# Altium project SR8_MPPT.PrjPcb (part 3 of 3)

## Sheet auxilliary.SchDoc: Auxiliary Support Circuits
size A3; DrawnBy: Angus Macdonald; SheetNumber: 4; SheetTotal: 5
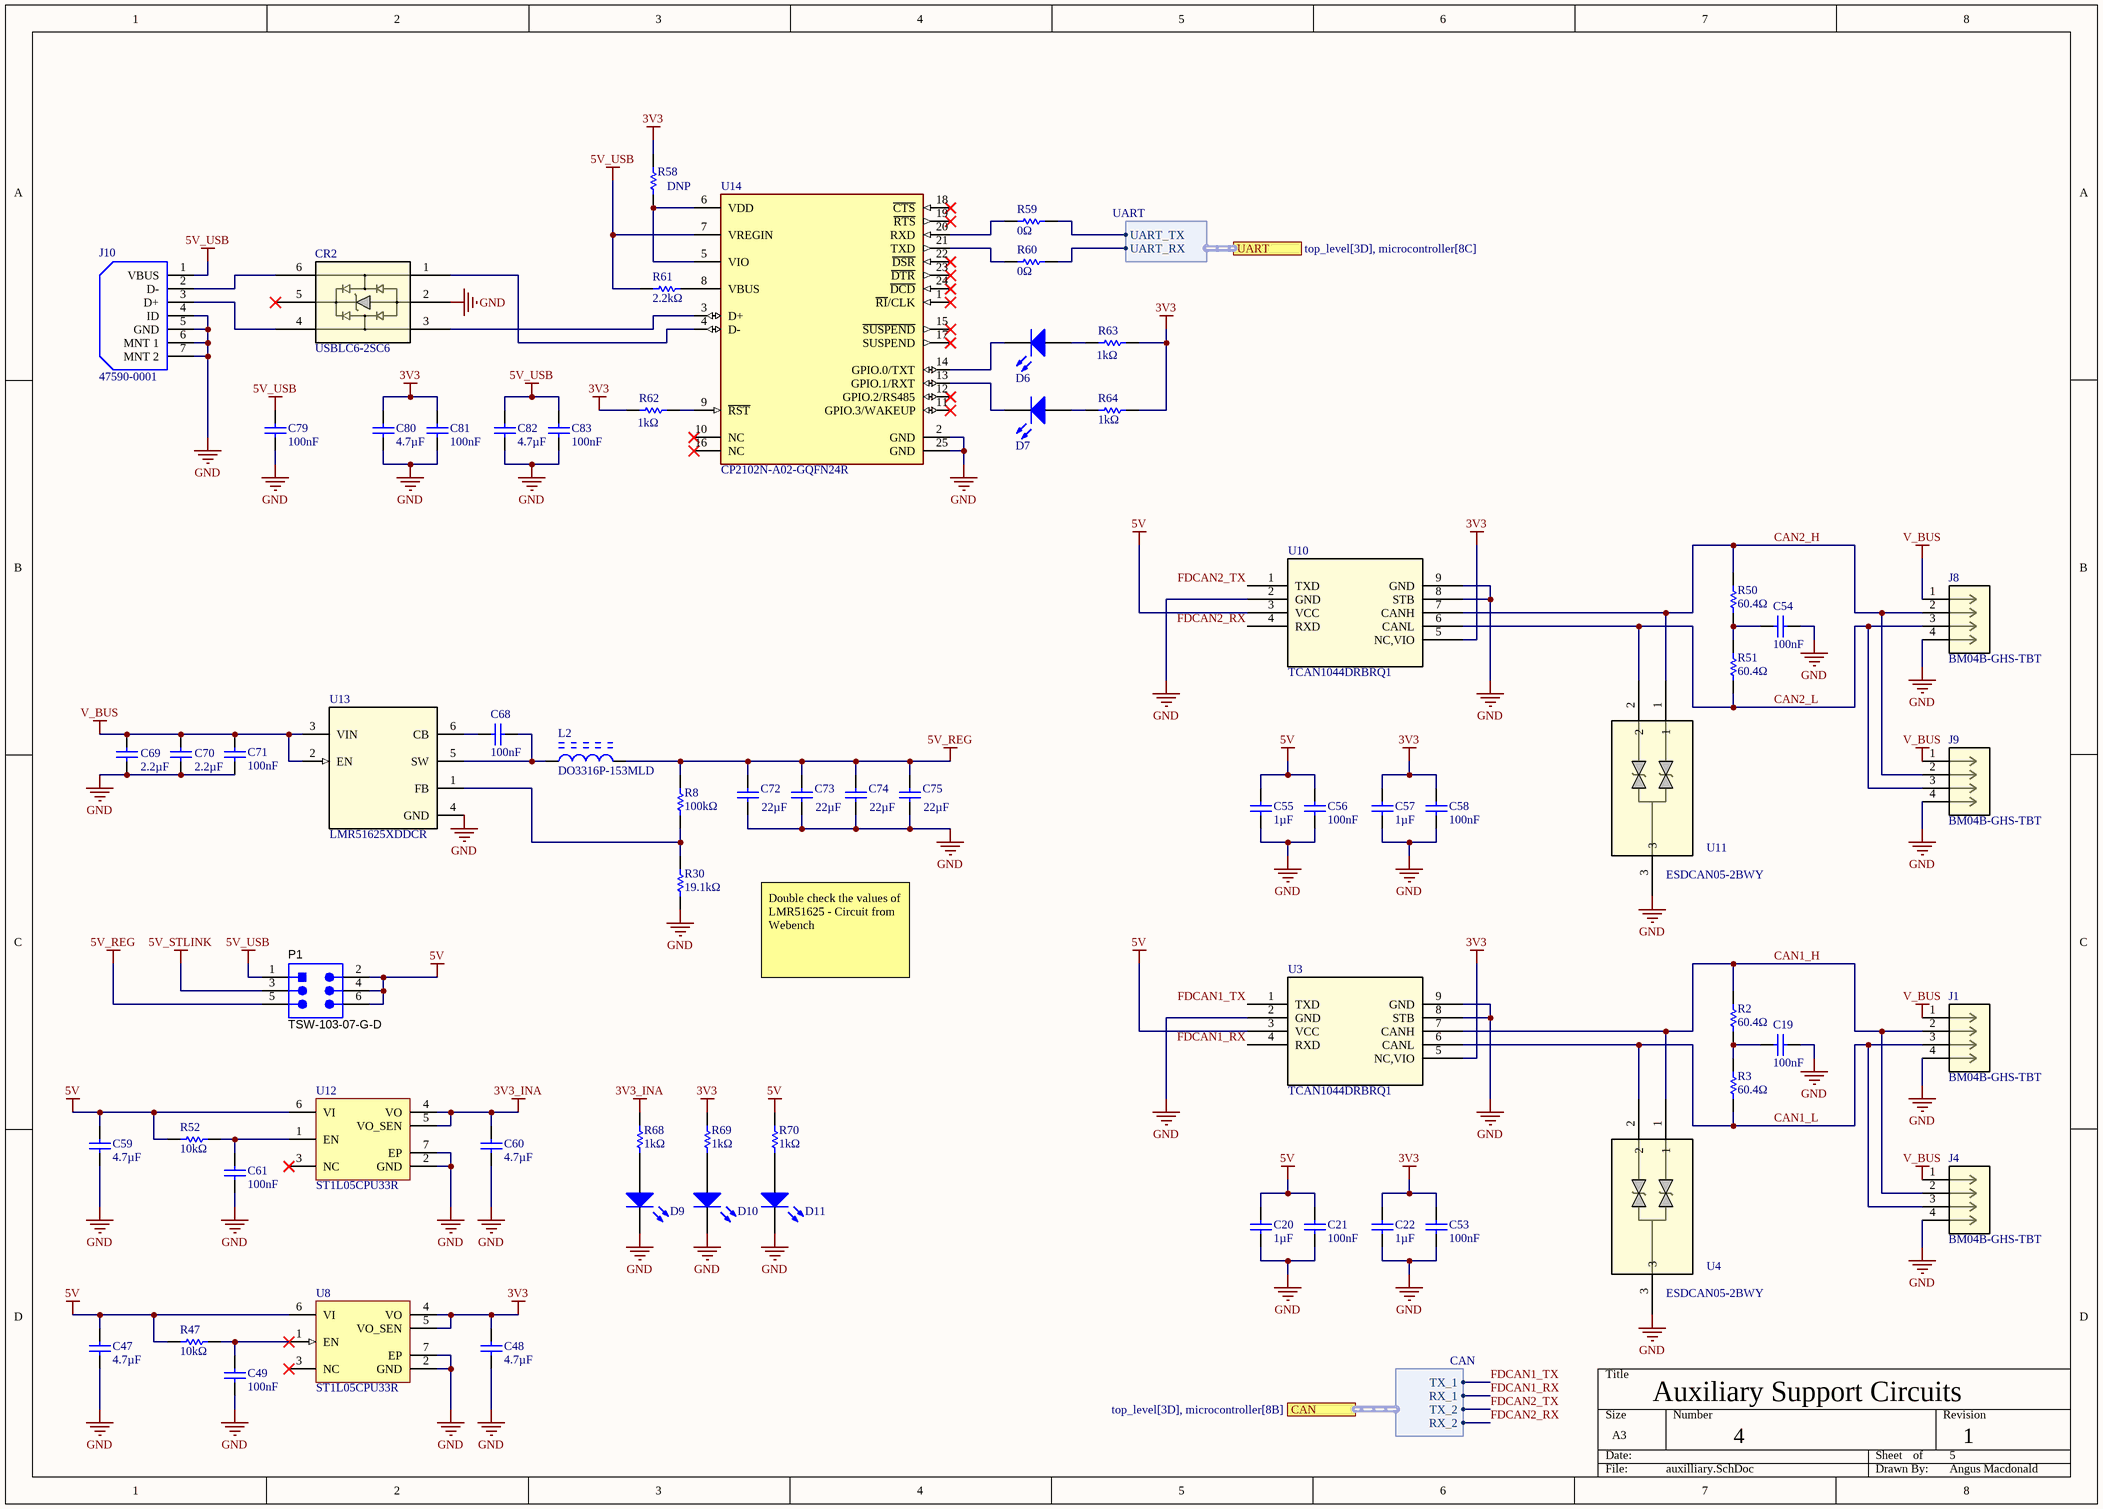
[diagram p4: auxilliary.SchDoc]

### Parts
C19  value 100nF  [C0603]  (hidden comment: CC0603KRX7R8BB104)
C20  value 1µF  [C0603]  (hidden comment: CC0603KRX7R7BB105)
C21  value 100nF  [C0603]  (hidden comment: CC0603KRX7R8BB104)
C22  value 1µF  [C0603]  (hidden comment: CC0603KRX7R7BB105)
C47  value 4.7µF  [C0603]  (hidden comment: CC0603KRX5R7BB475)
C48  value 4.7µF  [C0603]  (hidden comment: CC0603KRX5R7BB475)
C49  value 100nF  [C0603]  (hidden comment: CC0603KRX7R8BB104)
C53  value 100nF  [C0603]  (hidden comment: CC0603KRX7R8BB104)
C54  value 100nF  [C0603]  (hidden comment: CC0603KRX7R8BB104)
C55  value 1µF  [C0603]  (hidden comment: CC0603KRX7R7BB105)
C56  value 100nF  [C0603]  (hidden comment: CC0603KRX7R8BB104)
C57  value 1µF  [C0603]  (hidden comment: CC0603KRX7R7BB105)
C58  value 100nF  [C0603]  (hidden comment: CC0603KRX7R8BB104)
C59  value 4.7µF  [C0603]  (hidden comment: CC0603KRX5R7BB475)
C60  value 4.7µF  [C0603]  (hidden comment: CC0603KRX5R7BB475)
C61  value 100nF  [C0603]  (hidden comment: CC0603KRX7R8BB104)
C68  value 100nF  [C0603]  (hidden comment: CC0603JRX7R0BB104)
C69  value 2.2µF  [FP-CC1206-1_25-IPC_B]  (hidden comment: CC1206KKX7R0BB225)
C70  value 2.2µF  [FP-CC1206-1_25-IPC_B]  (hidden comment: CC1206KKX7R0BB225)
C71  value 100nF  [C0603]  (hidden comment: CC0603JRX7R0BB104)
C72  value 22µF  [FP-CC1206-1_25-IPC_B]  (hidden comment: CC1206KKX7R6BB226)
C73  value 22µF  [FP-CC1206-1_25-IPC_B]  (hidden comment: CC1206KKX7R6BB226)
C74  value 22µF  [FP-CC1206-1_25-IPC_B]  (hidden comment: CC1206KKX7R6BB226)
C75  value 22µF  [FP-CC1206-1_25-IPC_B]  (hidden comment: CC1206KKX7R6BB226)
C79  value 100nF  [C0603]  (hidden comment: CC0603KRX7R8BB104)
C80  value 4.7µF  [C0603]  (hidden comment: CC0603KRX5R7BB475)
C81  value 100nF  [C0603]  (hidden comment: CC0603KRX7R8BB104)
C82  value 4.7µF  [C0603]  (hidden comment: CC0603KRX5R7BB475)
C83  value 100nF  [C0603]  (hidden comment: CC0603KRX7R8BB104)
CR2  USBLC6-2SC6  [SOT23-6L_STM]
D6  LED RED 0805  [0805 LED]  (value not drawn)
D7  LED EMERALD 0805  [0805 LED]  (value not drawn)
D9  LED EMERALD 0805  [0805 LED]  (value not drawn)
D10  LED EMERALD 0805  [0805 LED]  (value not drawn)
D11  LED EMERALD 0805  [0805 LED]  (value not drawn)
J1  BM04B-GHS-TBT  [CONN_BM04B-GHS-TBT_JST]
J4  BM04B-GHS-TBT  [CONN_BM04B-GHS-TBT_JST]
J8  BM04B-GHS-TBT  [CONN_BM04B-GHS-TBT_JST]
J9  BM04B-GHS-TBT  [CONN_BM04B-GHS-TBT_JST]
J10  47590-0001  [USB]
L2  DO3316P-153MLD  [COIL-DO3316P_V]
P1  TSW-103-07-G-D  [SMTC-TSW-103-07-G-D_V]
R2  value 60.4Ω  [RESC1608X55X25ML10T15]  (hidden comment: RC0603FR-0760R4L)
R3  value 60.4Ω  [RESC1608X55X25ML10T15]  (hidden comment: RC0603FR-0760R4L)
R8  value 100kΩ  [RESC1608X55X25ML10T15]  (hidden comment: RC0603FR-07100KL)
R30  value 19.1kΩ  [RESC1608X55X25ML10T15]  (hidden comment: RC0603FR-0719K1L)
R47  value 10kΩ  [RESC1608X55X25ML10T15]  (hidden comment: RC0603FR-0710KL)
R50  value 60.4Ω  [RESC1608X55X25ML10T15]  (hidden comment: RC0603FR-0760R4L)
R51  value 60.4Ω  [RESC1608X55X25ML10T15]  (hidden comment: RC0603FR-0760R4L)
R52  value 10kΩ  [RESC1608X55X25ML10T15]  (hidden comment: RC0603FR-0710KL)
R58  DNP  [RESC1608X55X25ML10T15]
R59  value 0Ω  [RESC1608X55X25ML10T15]  (hidden comment: RC0603JR-070RL)
R60  value 0Ω  [RESC1608X55X25ML10T15]  (hidden comment: RC0603JR-070RL)
R61  value 2.2kΩ  [RESC1608X55X25ML10T15]  (hidden comment: RC0603FR-072K2L)
R62  value 1kΩ  [RESC1608X55X25ML10T15]  (hidden comment: RC0603FR-101KL)
R63  value 1kΩ  [RESC1608X55X25ML10T15]  (hidden comment: RC0603FR-101KL)
R64  value 1kΩ  [RESC1608X55X25ML10T15]  (hidden comment: RC0603FR-101KL)
R68  value 1kΩ  [RESC1608X55X25ML10T15]  (hidden comment: RC0603FR-101KL)
R69  value 1kΩ  [RESC1608X55X25ML10T15]  (hidden comment: RC0603FR-101KL)
R70  value 1kΩ  [RESC1608X55X25ML10T15]  (hidden comment: RC0603FR-101KL)
U3  TCAN1044DRBRQ1  [SON_4DRBRQ1_TEX]
U4  ESDCAN05-2BWY  [SOT323-3L_STM]
U8  ST1L05CPU33R  [DFN6D_L]
U10  TCAN1044DRBRQ1  [SON_4DRBRQ1_TEX]
U11  ESDCAN05-2BWY  [SOT323-3L_STM]
U12  ST1L05CPU33R  [DFN6D_L]
U13  LMR51625XDDCR  [DDC0006A-MFG]
U14  CP2102N-A02-GQFN24R  [FP-CP2102N-A02-GQFN24R-IPC_C]

### Ports
CAN (harness CAN, see top_level[3D], microcontroller[8B]), UART (harness UART, see top_level[3D], microcontroller[8C])

### Harnesses
CAN: TX_1, RX_1, TX_2, RX_2
UART: UART_TX, UART_RX

### Nets
3V3: C22.2 C48.2 C53.2 C57.2 C58.2 C80.2 C81.2 R58.1 R62.1 R63.2 R64.2 R69.1 U3.5(NC,VIO) U8.4(VO) U8.5(VO_SEN) U10.5(NC,VIO)
3V3_INA: C60.2 R68.1 U12.4(VO) U12.5(VO_SEN)
5V: C20.2 C21.2 C47.2 C55.2 C56.2 C59.2 P1.2 P1.4 P1.6 R47.1 R52.1 R70.1 U3.3(VCC) U8.6(VI) U10.3(VCC) U12.6(VI)
5V_REG: C72.1 C73.1 C74.1 C75.1 L2.2 P1.5 R8.2
5V_STLINK: P1.3
5V_USB: C79.2 C82.2 C83.2 J10.1(VBUS) P1.1 R61.2 U14.7(VREGIN)
GND: C19.1 C20.1 C21.1 C22.1 C47.1 C48.1 C49.1 C53.1 C54.1 C55.1 C56.1 C57.1 C58.1 C59.1 C60.1 C61.1 C69.2 C70.2 C71.2 C72.2 C73.2 C74.2 C75.2 C79.1 C80.1 C81.1 C82.1 C83.1 CR2.2 D9.K D10.K D11.K J1.4 J4.4 J8.4 J9.4 J10.4(ID) J10.5(GND) J10.6(MNT_1) J10.7(MNT_2) R30.1 U3.2(GND) U3.8(STB) U3.9(GND) U4.3 U8.2(GND) U8.7(EP) U10.2(GND) U10.8(STB) U10.9(GND) U11.3 U12.2(GND) U12.7(EP) U13.4(GND) U14.2(GND) U14.25(GND)
V_BUS: C69.1 C70.1 C71.1 J1.1 J4.1 J8.1 J9.1 U13.2(EN) U13.3(VIN)
CAN1_H: J1.2 J4.2 R2.2 U3.7(CANH) U4.1
CAN1_L: J1.3 J4.3 R3.1 U3.6(CANL) U4.2
CAN2_H: J8.2 J9.2 R50.2 U10.7(CANH) U11.1
CAN2_L: J8.3 J9.3 R51.1 U10.6(CANL) U11.2
FDCAN1_RX: U3.4(RXD) ; port CAN.RX_1
FDCAN1_TX: U3.1(TXD) ; port CAN.TX_1
FDCAN2_RX: U10.4(RXD) ; port CAN.RX_2
FDCAN2_TX: U10.1(TXD) ; port CAN.TX_2
UART_RX: R60.1 ; port UART.UART_RX
UART_TX: R59.1 ; port UART.UART_TX
NetC19_2: C19.2 R2.1 R3.2
NetC49_2: C49.2 R47.2 U8.1(EN)
NetC54_2: C54.2 R50.1 R51.2
NetC61_2: C61.2 R52.2 U12.1(EN)
NetC68_1: C68.1 U13.6(CB)
NetC68_2: C68.2 L2.1 U13.5(SW)
NetCR2_1: CR2.1 U14.4(D-)
NetCR2_3: CR2.3 U14.3(D+)
NetCR2_4: CR2.4 J10.3(D+)
NetCR2_6: CR2.6 J10.2(D-)
NetD6_A: D6.A R63.1
NetD6_K: D6.K U14.14(GPIO.0/TXT)
NetD7_A: D7.A R64.1
NetD7_K: D7.K U14.13(GPIO.1/RXT)
NetD9_A: D9.A R68.2
NetD10_A: D10.A R69.2
NetD11_A: D11.A R70.2
NetR8_1: R8.1 R30.2 U13.1(FB)
NetR58_2: R58.2 U14.5(VIO) U14.6(VDD)
NetR59_2: R59.2 U14.20(RXD)
NetR60_2: R60.2 U14.21(TXD)
NetR61_1: R61.1 U14.8(VBUS)
NetR62_2: R62.2 U14.9(~{RST})

Not connected (* = marked no-connect by the designer): CR2 5*; U8 3(NC)*; U12 3(NC)*; U14 1(~{RI}/CLK)* 10(NC)* 11(GPIO.3/WAKEUP)* 12(GPIO.2/RS485)* 15(~{SUSPEND})* 16(NC)* 17(SUSPEND)* 18(~{CTS})* 19(~{RTS})* 22(~{DSR})* 23(~{DTR})* 24(~{DCD})*

### Notes on the sheet
- Double check the values of LMR51625 - Circuit from Webench

### Library data of the parts
C19 C21 C49 C53 C54 C56 C58 C61 C79 C81 C83 = CMP-00179-1: 25V 100nF X7R ±10% 0603 Multilayer Ceramic Capacitors MLCC - SMD/SMT ROHS; Length: 1.6mm; Pins: 2; Case/Package: 0603; Composition: Ceramic; Lead Free: Lead Free; Lifecycle Status: Production; RoHS: Compliant; China RoHS: Compliant; Number of Terminals: 2; Max Operating Temperature: 125°C; Tolerance: 10%; Width: 800µm; Dielectric Material: Ceramic; Voltage Rating (DC): 25V; Depth: 800µm; Min Operating Temperature: -55°C; Halogen Free: Halogen Free; Mounting Technology: Surface Mount; Material: Ceramic; REACH SVHC: Yes; Case Code (Imperial): 0603; Height: 800µm; Schedule B: 8532240020, 8532240020; Voltage Rating: 25V; Thickness: 889µm; Termination: SMD/SMT; Dielectric: X7R; Radiation Hardening: No; Voltage: 25V; Case Code (Metric): 1608
C20 C22 C55 C57 = CMP-00211-1: 16V 1uF X7R ±10% 0603 Multilayer Ceramic Capacitors MLCC - SMD/SMT ROHS; Dissipation Factor: 5%; Harmonized Tariff Schedule (HTS) Code: 8532.24.00.20; Width: 800µm; Country of Origin: Mainland China, Taiwan; Case Code (Imperial): 0603; Schedule B: 8532240020, 8532240020; Halogen Free: Halogen Free; Lifecycle Status: Production; China RoHS: Compliant; Max Operating Temperature: 125°C; Export Control Classification Number (ECCN) Code: EAR99; Min Operating Temperature: -55°C; Radiation Hardening: No; Dielectric Material: Ceramic; Voltage: 16V; RoHS: Compliant; Voltage Rating (DC): 16V; Termination: SMD/SMT; Material: Ceramic; Mounting Technology: Surface Mount; Case Code (Metric): 1608; Case/Package: 0603; Depth: 800µm; Voltage Rating: 16V; Dielectric: X7R; Thickness: 889µm; Lead Free: Lead Free; Length: 1.6mm; REACH SVHC: Yes; Height: 800µm; Introduction Date: 2009-04-17; Tolerance: 10%; Composition: Ceramic; Number of Terminals: 2; Pins: 2
C47 C48 C59 C60 C80 C82 = CMP-00273-1: 16V 4.7uF X5R ±10% 0603 Multilayer Ceramic Capacitors MLCC - SMD/SMT ROHS; Halogen Free: Halogen Free; Depth: 800µm; Case/Package: 0603; China RoHS: Compliant; REACH SVHC: Yes; Height: 800µm; Harmonized Tariff Schedule (HTS) Code: 8532.24.00.20; Width: 800µm; Export Control Classification Number (ECCN) Code: EAR99; Voltage Rating (DC): 16V; Number of Terminals: 2; Country of Origin: Mainland China, Taiwan; Thickness: 939.8µm; Material: Ceramic; Introduction Date: 2013-02-05; RoHS: Compliant; Dielectric: X5R; Voltage Rating: 16V; Max Operating Temperature: 85°C; Case Code (Imperial): 0603; Mounting Technology: Surface Mount; Composition: Ceramic; Min Operating Temperature: -55°C; Length: 1.6mm; Tolerance: 10%; Lead Free: Lead Free; Lifecycle Status: Production; Schedule B: 8532240020, 8532240020; Dielectric Material: Ceramic; Termination: SMD/SMT; Case Code (Metric): 1608; Weight: 2.012816mg
C68 C71 = CMP-00275-1: Ceramic Capacitor, Ceramic, 100V, 5% +Tol, 5% -Tol, X7R, 0.15 TC, 0.1uF, Surface Mount, 0603; RoHS: Compliant; Voltage Rating (DC): 100V; Length: 1.6mm; Dielectric Material: Ceramic; REACH SVHC: Yes; Case/Package: 0603; China RoHS: Compliant; Mounting Technology: Surface Mount; Height: 800µm; Lifecycle Status: Production; Width: 800µm; Min Operating Temperature: -55°C; Number of Terminals: 2; Max Operating Temperature: 125°C
C69 C70 = CMP-00184-1: 1206 2.2 uF 100 V ±10% Tolerance X7R SMT Multilayer Ceramic Chip Capacitor; Voltage Rating: 100V; Lifecycle Status: Production; RoHS: Compliant; REACH SVHC: Yes; Height: 1.6mm; Schedule B: 8532240020, 8532240020; Max Operating Temperature: 125°C; Number of Terminals: 2; Dielectric Material: Ceramic; Width: 1.6mm; Case/Package: 1206; Length: 3.2mm; Thickness: 1.4478mm; Tolerance: 10%; Min Operating Temperature: -55°C; Mounting Technology: Surface Mount; Material: Ceramic; Voltage Rating (DC): 100V; China RoHS: Compliant
C72-C75 = CMP-00279-1: 10V 22uF X7R ±10% 1206 Multilayer Ceramic Capacitors MLCC - SMD/SMT ROHS; Mounting Technology: Surface Mount; Dielectric Material: Ceramic; Case Code (Metric): 3216; Lifecycle Status: Production; Halogen Free: Halogen Free; Lead Free: Lead Free; Voltage Rating (DC): 10V; Termination: SMD/SMT; Schedule B: 8532240020, 8532240020; Dielectric: X7R; RoHS: Compliant; Case Code (Imperial): 1206; Thickness: 1.8034mm; Case/Package: 1206; China RoHS: Compliant; Harmonized Tariff Schedule (HTS) Code: 8532.24.00.20; Width: 1.6mm; Max Operating Temperature: 125°C; Min Operating Temperature: -55°C; Export Control Classification Number (ECCN) Code: EAR99; Packaging: Tape & Reel (TR); Length: 3.2mm; Country of Origin: Mainland China, Taiwan; Tolerance: 10%; Composition: Ceramic; REACH SVHC: Yes; Height: 1.6mm; Voltage Rating: 10V; Weight: 16.187578mg; Introduction Date: 2014-07-08; Number of Terminals: 2
CR2 = CMP-304-000000-1: ESD Protection for USB 2.0 High Speed; Manufacturer_Name: STMicroelectronics; Type: Type; Design Item ID: USBLC6-2SC6; RefDes: RefDes; Source: USBLC6-2SC6.SchLib; Manufacturer_Part_Number: USBLC6-2SC6; Copyright: Copyright (C) 2025 Ultra Librarian. All rights reserved.
D6 = CMP-002-000018-2: Red 0805  Light Emitting Diodes (LED) ROHS JLCPCB PICK&PLACE; Manufacturer: Foshan NationStar Optoelectronics; MFR.Part #: C84256; JLCPCB Part #: C84256; Color: Red
D7 D9-D11 = CMP-002-000017-2: Emerald 0805  Light Emitting Diodes (LED) ROHS GREEN JLCPCB PICK&PLACE; MFR.Part #: C2297; Manufacturer: Hubei KENTO Elec; Color: Emerald; JLCPCB Part #: C2297
J1 J4 J8 J9 = CMP-189-000000-2: Description; Manufacturer_Name: JST; Source: BM04B-GHS-TBT.SchLib; Copyright: Copyright (C) 2026 Ultra Librarian. All rights reserved.; Design Item ID: BM04B-GHS-TBT; Type: Type; Manufacturer_Part_Number: BM04B-GHS-TBT; RefDes: RefDes
J10 = CMP-014-000015-2: USB Connector Micro-AB SMD, 5 Contact(s), Female, Right Angle, Surface Mount Terminal, Locking, Receptacle, JLCPCB, PICK&PLACE; Manufacturer: MOLEX; MFR.Part #: 475900001; Source: https://jlcpcb.com/partdetail/Molex-475900001/C136001; JLCPCB Part #: C136001
L2 = CMP-050-000032-1: General Purpose Inductor, 15uH, 20%, 1 Element, Ferrite-Core, SMD, 5137; Self Resonant Frequency: 27MHz; Max DC Current: 3.1A; DC Resistance (DCR): 46mΩ; Value: 15µH; Shielding: Unshielded; Test Frequency: 100kHz; Saturation Current: 3A; Number of Circuits: 1; Length: 12.95mm; Country of Origin: Mainland China; Tolerance: 20%; Introduction Date: 2005-05-06; Min Operating Temperature: -40°C; Termination: SMD/SMT; Max Operating Temperature: 85°C; RoHS: Compliant; RMS Current (Irms): 3.1A; Core Material: Ferrite; Max Current Rating: 3.1A; REACH SVHC: Yes; Packaging: Cut Tape; Number of Terminals: 2; Width: 9.4mm; Lead Free: Contains Lead; Height: 5.21mm; Inductance Tolerance: 20%; Lifecycle Status: Production; Export Control Classification Number (ECCN) Code: EAR99; Harmonized Tariff Schedule (HTS) Code: 8504.50.80.00
P1 = CMP-014-000047-1: CONN HEADER VERT 6POS 2.54MM / Connector Header Through Hole 6 position 0.100" (2.54mm); Manufacturer Lifecycle Status: PRODUCTION; Max Voltage Rating (AC): 550V; Number of Contacts: 6; Connector Type: Male Pin; Gender: Male; Max Current Rating: 7.6A; Orientation: Straight; Width: 5.08mm; Pins: 6; Row Spacing: 2.54mm; Termination: Solder; REACH SVHC: No; Mounting Technology: Through Hole; Lead Pitch: 2.54mm; Number of Positions: 6; Lead Free: Lead Free; Number of Rows: 2; Min Operating Temperature: -55°C; Pitch: 2.54mm; Packaging: Bulk; Housing Color: Black; Contact Mating Length: 5.842mm; Contact Material: Bronze; RoHS: Compliant; Radiation Hardening: No; Color: Black; Depth: 5.08mm; Max Operating Temperature: 125°C; Lifecycle Status: Production; Contact Plating: Gold; Housing Material: Polyester
R2 R3 R50 R51 = CMP-RES-00051-1: Res Thick Film 0603 60.4 Ohm 1% 0.1W(1/10W) ±100ppm/C Pad SMD T/R; Working Voltage: 75V; Temperature Coefficient: 100ppm/°C; Power Dissipation: 100mW; Voltage Rating (DC): 50V; Introduction Date: 2004-09-22; Number of Terminals: 2; Harmonized Tariff Schedule (HTS) Code: 8533.21.00.30; Export Control Classification Number (ECCN) Code: EAR99; Height: 450µm; Width: 800µm; Tolerance: 1%; Case/Package: 0603; Lifecycle Status: Production; Packaging: Tape & Reel; Depth: 800µm; Power Rating: 100mW; RoHS: Compliant; Voltage Rating: 75V; REACH SVHC: Yes; Schedule B: 8533210045, 8533210045; China RoHS: Non-Compliant; Min Operating Temperature: -55°C; Country of Origin: Mainland China, Taiwan; Composition: Thick Film; Termination: SMD/SMT; Case Code (Imperial): 0603; Length: 1.6mm; Lead Free: Lead Free; Military Standard: Not; Max Operating Temperature: 155°C; Mounting Technology: Surface Mount
R8 = CMP-RES-00026-1: Res General Purpose Thick Film 0603 100k Ohm 1% 1/10W ±100ppm/°C Molded Paper T/R; Working Voltage: 75V; Voltage Rating (DC): 50V; Power Dissipation: 100mW; Tolerance: 1%; Number of Terminations: 2; Pins: 2; China RoHS: Non-Compliant; Schedule B: 8533210045, 8533210045; Military Standard: Not; Max Operating Temperature: 155°C; Depth: 800µm; Height: 450µm; Voltage Rating: 75V; Case/Package: 0603; Length: 1.6mm; Packaging: Tape & Reel; RoHS: Compliant; Width: 800µm; Power Rating: 100mW; Number of Terminals: 2; Case Code (Imperial): 0603; Lead Free: Lead Free; Termination: SMD/SMT; Case Code (Metric): 0603; Mounting Technology: Surface Mount; Composition: Thick Film; Min Operating Temperature: -55°C; REACH SVHC: Yes; Temperature Coefficient: 100ppm/°C; Lifecycle Status: Production
R30 = CMP-RES-00091-1: 100mW Thick Film Resistors 75V ±100ppm/℃ ±1% 19.1kΩ 0603 Chip Resistor - Surface Mount ROHS; Voltage Rating (DC): 50V; Temperature Coefficient: 100ppm/°C; Contact Plating: Tin; Working Voltage: 75V; REACH SVHC: Yes; Mounting Technology: Surface Mount; Case/Package: 0603; Lead Free: Lead Free; Voltage Rating: 75V; China RoHS: Non-Compliant; Lifecycle Status: Production; Min Operating Temperature: -55°C; Max Operating Temperature: 155°C; Height: 450µm; Number of Terminals: 2; Packaging: Tape & Reel; Composition: Thick Film; Power Rating: 100mW; Length: 1.6mm; Depth: 800µm; Tolerance: 1%; Schedule B: 8533210045, 8533210045; Case Code (Imperial): 0603; Military Standard: Not; Number of Terminations: 2; Termination: SMD/SMT; Width: 800µm; RoHS: Compliant
R47 R52 = CMP-RES-00040-1: 10 kOhms ±1% 0.1W, 1/10W Chip Resistor 0603 (1608 Metric) Moisture Resistant Thick Film; Tolerance: 1%; Case/Package: 0603
R58 = CMP-RES-00050-1: GENERAL PURPOSE CHIP RESISTOR Metal Glaze/thick Film, 0.1W, 0ohm, Surface Mount, 0603; Power Rating: 100mW; Tolerance: 1%; Voltage Rating: 50V; Value: 0Ω; Temperature Coefficient: 200ppm/°C; Termination: SMD/SMT; Number of Terminals: 2; Pins: 2; Contact Plating: Tin; Case/Package: 0603; Length: 1.6mm; Military Standard: Not; Power Dissipation: 100mW; Introduction Date: 2001-06-08; Case Code (Imperial): 0603; Voltage Rating (DC): 50V; Min Operating Temperature: -55°C; Composition: Thick Film; Export Control Classification Number (ECCN) Code: EAR99; Country of Origin: Mainland China, Taiwan; Height: 450µm; RoHS: Compliant; Depth: 800µm; Lifecycle Status: Production; Width: 800µm; Max Operating Temperature: 155°C; Harmonized Tariff Schedule (HTS) Code: 8533.21.00.30; Radiation Hardening: No; Packaging: Cut Tape; China RoHS: Non-Compliant; Lead Free: Lead Free; REACH SVHC: Yes; Mounting Technology: Surface Mount
R59 R60 = CMP-RES-00050-1: GENERAL PURPOSE CHIP RESISTOR Metal Glaze/thick Film, 0.1W, 0ohm, Surface Mount, 0603; Power Rating: 100mW; Tolerance: 1%; Voltage Rating: 50V; Temperature Coefficient: 200ppm/°C; Termination: SMD/SMT; Number of Terminals: 2; Pins: 2; Contact Plating: Tin; Case/Package: 0603; Length: 1.6mm; Military Standard: Not; Power Dissipation: 100mW; Introduction Date: 2001-06-08; Case Code (Imperial): 0603; Voltage Rating (DC): 50V; Min Operating Temperature: -55°C; Composition: Thick Film; Export Control Classification Number (ECCN) Code: EAR99; Country of Origin: Mainland China, Taiwan; Height: 450µm; RoHS: Compliant; Depth: 800µm; Lifecycle Status: Production; Width: 800µm; Max Operating Temperature: 155°C; Harmonized Tariff Schedule (HTS) Code: 8533.21.00.30; Radiation Hardening: No; Packaging: Cut Tape; China RoHS: Non-Compliant; Lead Free: Lead Free; REACH SVHC: Yes; Mounting Technology: Surface Mount
R61 = CMP-RES-00092-1: 100Mw Thick Film Resistors 100Ppm/ 1% 2.2K 0603 Chip Resistor Surface Mount Rohs; Voltage Rating (DC): 50V; Temperature Coefficient: 100ppm/°C; Working Voltage: 75V; Number of Terminals: 2; Composition: Thick Film; Contact Plating: Tin; Mounting Technology: Surface Mount; Harmonized Tariff Schedule (HTS) Code: 8533.21.00.30; Features: Moisture Resistant; Case Code (Imperial): 0603; Max Power Dissipation: 100mW; Lifecycle Status: Production; REACH SVHC: Yes; Number of Terminations: 2; Case/Package: 0603; Pins: 2; Schedule B: 8533210045, 8533210045; Packaging: Tape & Reel; China RoHS: Non-Compliant; Case Code (Metric): 0603; Depth: 800µm; Military Standard: Not; Length: 1.6mm; Introduction Date: 2004-09-22; Min Operating Temperature: -55°C; Tolerance: 1%; Height: 450µm; Termination: SMD/SMT; Width: 800µm; Country of Origin: Mainland China, Taiwan; Lead Free: Lead Free; Radiation Hardening: No; Voltage Rating: 75V; Max Operating Temperature: 155°C; RoHS: Compliant; Export Control Classification Number (ECCN) Code: EAR99; Power Rating: 100mW
R62-R64 R68-R70 = CMP-RES-00029-1: 1 kOhms ±1% 0.1W, 1/10W Chip Resistor 0603 (1608 Metric) Moisture Resistant Thick Film; Case/Package: 0603; Tolerance: 1%
U3 U10 = CMP-157-000000-1: Automotive high-speed CAN transceiver 8-SON -40 to 125; Manufacturer_Name: Texas Instruments; Type: Type; RefDes: RefDes; Source: TCAN1044DRBRQ1.SchLib; Copyright: Copyright (C) 2025 Ultra Librarian. All rights reserved.; Datasheet: https://www.ti.com/lit/gpn/tcan1044-q1; Design Item ID: TCAN1044DRBRQ1; Manufacturer_Part_Number: TCAN1044DRBRQ1
U4 U11 = CMP-002-000046-1: Automotive dual-line TVS in SOT323-3L for CAN bus (24 V system); Manufacturer_Name: STMicroelectronics; Design Item ID: ESDCAN05-2BWY; Source: ESDCAN05-2BWY.SchLib; Manufacturer_Part_Number: ESDCAN05-2BWY; Type: Type; RefDes: RefDes; Copyright: Copyright (C) 2025 Ultra Librarian. All rights reserved.
U8 U12 = CMP-015-000054-1: ST1L05 Series 1.3 A 3.3 V Fixed Output LDO BICMOS Voltage Regulator - DFN-6; Number of Circuits: 1; Min Output Voltage: 3.3V; Polarity: Positive; Output Voltage Accuracy: 2%; Min Input Voltage: 3V; Dropout Voltage: 300mV; Voltage Tolerance: 2.5%; Output Current: 1.3A; Max Supply Voltage: 5.5V; Quiescent Current: 500µA; Max Junction Temperature (Tj): 125°C; China RoHS: Compliant; Lead Free: Lead Free; Introduction Date: 2008-02-29; Harmonized Tariff Schedule (HTS) Code: 8542.39.00.60; Output Type: Fixed; Export Control Classification Number (ECCN) Code: EAR99; Max Operating Temperature: 125°C; RoHS: Compliant; Length: 3mm; Case/Package: DFN; Min Current Limit: 1.3A; Accuracy: 2%; Min Operating Temperature: 0°C; REACH SVHC: Yes; Height - Seated (Max): 1mm; Pins: 6; Radiation Hardening: No; Number of Terminals: 6; Schedule B: 8542390000, 8542390000; Packaging: Cut Tape (CT); Mounting Technology: Surface Mount; Number of Channels: 1; Number of Regulators: 1; Output Voltage: 3.3V; Width: 3mm; Country of Origin: Malaysia; Number of Outputs: 1; Terminal Pitch: 950µm; Lifecycle Status: Production; Max Output current: 1.3A
U13 = CMP-007-000012-2: SIMPLE SWITCHERÂ® synchronous buck converter with 4.3V-to-60V, 2.5A and low quiescent current 6-SOT-23-THIN -40 to 150; Manufacturer_Name: Texas Instruments; Design Item ID: LMR51625XDDCR; TYPE: TYPE; Manufacturer_Part_Number: LMR51625XDDCR; Copyright: Copyright (C) 2026 Ultra Librarian. All rights reserved.; Source: LMR51625XDDCR.SchLib; RefDes: RefDes
U14 = CMP-071-000004-1: IC Usb to Uart Bridge QFN24 / Usb Bridge, Usb to Uart Usb 2.0 Uart Interface 24-QFN (4X4); Manufacturer Lifecycle Status: FULL PRODUCTION; Nominal Supply Voltage (DC): 3.3V; Min Supply Voltage: 3V; Max Supply Voltage: 3.6V; Number of Digital IO: 4; Max Junction Temperature (Tj): 105°C; Data Rate: 1.5Mbps; Number of Terminals: 24; China RoHS: Compliant; Min Operating Temperature: -40°C; Length: 4mm; Terminal Pitch: 500µm; Schedule B: 8542390000, 8542390000; RoHS: Compliant; Max Operating Temperature: 85°C; Interface: UART; Ambient Temperature Range High: 85°C; REACH SVHC: Yes; Width: 4mm; Harmonized Tariff Schedule (HTS) Code: 8542.31.00.30; Height: 800µm; Temperature Grade: Industrial; Height - Seated (Max): 800µm; Lifecycle Status: Production; Introduction Date: 2019-03-12

## Nets that join several sheets
3V3: microcontroller (40 pins), st_link (16 pins), auxilliary (16 pins)
3V3_INA: B1 (13 pins), B2 (12 pins), B3 (15 pins), B4 (14 pins), B5 (13 pins), auxilliary (C60.2 R68.1 U12.4 U12.5)
5V: B1 (C25_B1.2 C51_B1.2 U7_B1.14), B2 (C25_B2.2 C51_B2.2 U7_B2.14), B3 (C25_B3.2 C51_B3.2 U7_B3.14), B4 (C25_B4.2 C51_B4.2 U7_B4.14), B5 (C25_B5.2 C51_B5.2 U7_B5.14), auxilliary (16 pins)
5V_STLINK: st_link (J3.1 R39.1), auxilliary (P1.3)
GND: top_level (11 pins), B1 (35 pins), B2 (34 pins), B3 (33 pins), B4 (32 pins), B5 (33 pins), microcontroller (53 pins), st_link (21 pins), auxilliary (56 pins)
V_BAT: top_level (12 pins), microcontroller (R31.2 R32.2)
V_BUS: top_level (D16.1), auxilliary (9 pins)
V_PV: top_level (15 pins), B1 (R5_B1.2 R56_B1.2 U5_B1.8), B2 (R5_B2.2 R56_B2.2 U5_B2.8), B3 (R5_B3.2 R56_B3.2 U5_B3.8), B4 (R5_B4.2 R56_B4.2 U5_B4.8), B5 (R5_B5.2 R56_B5.2 U5_B5.8)
ALERT1: B1 (U6_B1.3), B2 (U6_B2.3), B3 (U6_B3.3), B4 (U6_B4.3), B5 (U6_B5.3), microcontroller (R48.1 U1.135)
ALERT2: B1 (U5_B1.3), B2 (U5_B2.3), B3 (U5_B3.3), B4 (U5_B4.3), B5 (U5_B5.3), microcontroller (R96.1 U1.12)
FDCAN1_RX: microcontroller (U1.114), auxilliary (U3.4)
FDCAN1_TX: microcontroller (U1.115), auxilliary (U3.1)
FDCAN2_RX: microcontroller (U1.73), auxilliary (U10.4)
FDCAN2_TX: microcontroller (U1.74), auxilliary (U10.1)
FLT_1: B1 (R16_B1.1 U16_B1.6), microcontroller (R14.1 U1.110)
FLT_2: B2 (R16_B2.1 U16_B2.6), microcontroller (U1.112)
FLT_3: B3 (R16_B3.1 U16_B3.6), microcontroller (U1.118)
FLT_4: B4 (R16_B4.1 U16_B4.6), microcontroller (R15.1 U1.133)
FLT_5: B5 (R16_B5.1 U16_B5.6), microcontroller (U1.125)
HI_1: B1 (D5_B1.6 R6_B1.2), microcontroller (U1.97)
HI_2: B2 (D5_B2.6 R6_B2.2), microcontroller (U1.100)
HI_3: B3 (D5_B3.6 R6_B3.2), microcontroller (U1.102)
HI_4: B4 (D5_B4.6 R6_B4.2), microcontroller (U1.104)
HI_5: B5 (D5_B5.6 R6_B5.2), microcontroller (U1.92)
I_IND_1: B1 (R83_B1.2 U16_B1.2), microcontroller (R10.1)
I_IND_2: B2 (R83_B2.2 U16_B2.2), microcontroller (R17.1)
I_IND_3: B3 (R83_B3.2 U16_B3.2), microcontroller (R18.1)
I_IND_4: B4 (R83_B4.2 U16_B4.2), microcontroller (R19.1)
I_IND_5: B5 (R83_B5.2 U16_B5.2), microcontroller (R20.1)
INJECT_EN: top_level (R71.2 U15.1), microcontroller (U1.119)
LED_TOG_1: B1 (D1_B1.K D4_B1.A), microcontroller (U1.40)
LED_TOG_2: B2 (D1_B2.K D4_B2.A), microcontroller (U1.41)
LED_TOG_3: B3 (D1_B3.K D4_B3.A), microcontroller (U1.45)
LED_TOG_4: B4 (D1_B4.K D4_B4.A), microcontroller (U1.46)
LED_TOG_5: B5 (D1_B5.K D4_B5.A), microcontroller (U1.48)
LI_1: B1 (D5_B1.3 R7_B1.2), microcontroller (U1.96)
LI_2: B2 (D5_B2.3 R7_B2.2), microcontroller (U1.98)
LI_3: B3 (D5_B3.3 R7_B3.2), microcontroller (U1.101)
LI_4: B4 (D5_B4.3 R7_B4.2), microcontroller (U1.103)
LI_5: B5 (D5_B5.3 R7_B5.2), microcontroller (U1.91)
NTC_1: B1 (R9_B1.1 R34_B1.2), microcontroller (R21.1)
NTC_2: B2 (R9_B2.1 R34_B2.2), microcontroller (R22.1)
NTC_3: B3 (R9_B3.1 R34_B3.2), microcontroller (R23.1)
NTC_4: B4 (R9_B4.1 R34_B4.2), microcontroller (R24.1)
NTC_5: B5 (R9_B5.1 R34_B5.2), microcontroller (R25.1)
SCL1: B1 (U6_B1.5), B2 (U6_B2.5), B3 (U6_B3.5), B4 (U6_B4.5), B5 (U6_B5.5), microcontroller (R49.1 R78.2 U1.136)
SCL2: B1 (U5_B1.5), B2 (R11_B2.2 U5_B2.5), B3 (U5_B3.5), B4 (R11_B4.2 U5_B4.5), B5 (U5_B5.5), microcontroller (J5.2 R78.1 R80.1 U1.11)
SDA1: B1 (U6_B1.4), B2 (R12_B2.1 U6_B2.4), B3 (U6_B3.4), B4 (R12_B4.1 U6_B4.4), B5 (R86_B5.1 U6_B5.4), microcontroller (R79.2 R95.1 U1.137)
SDA2: B1 (U5_B1.4), B2 (U5_B2.4), B3 (U5_B3.4), B4 (U5_B4.4), B5 (R13_B5.2 U5_B5.4), microcontroller (J5.3 R79.1 R81.1 U1.10)
T_CLK: microcontroller (P2.4 U1.109), st_link (U2.15 U2.26)
T_DIO: microcontroller (P2.2 U1.105), st_link (R36.2 U2.27)
T_RST: microcontroller (6 pins), st_link (U2.18)
T_SWO: microcontroller (P2.6 R15.2), st_link (U2.31)
UART_RX: microcontroller (U1.116), auxilliary (R60.1)
UART_TX: microcontroller (U1.113), auxilliary (R59.1)